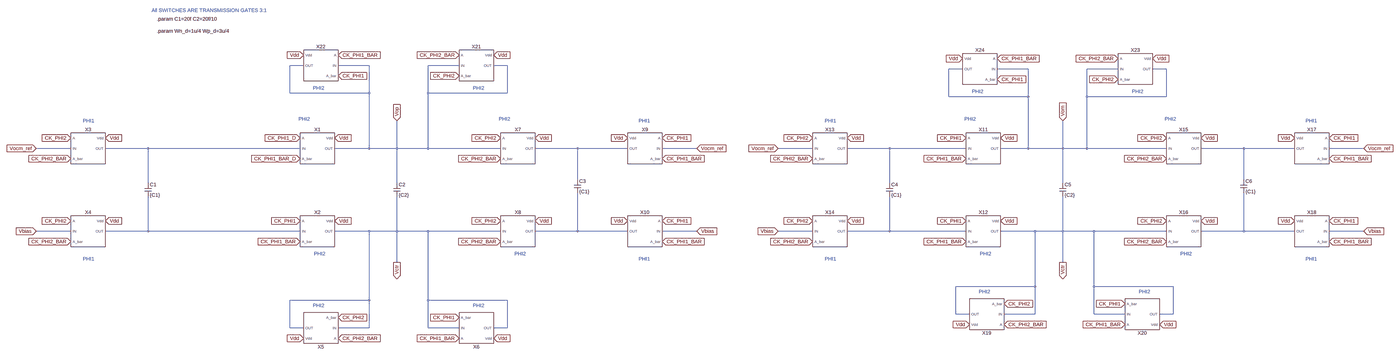
[diagram p0: schematic Draft7.asc, whole sheet]
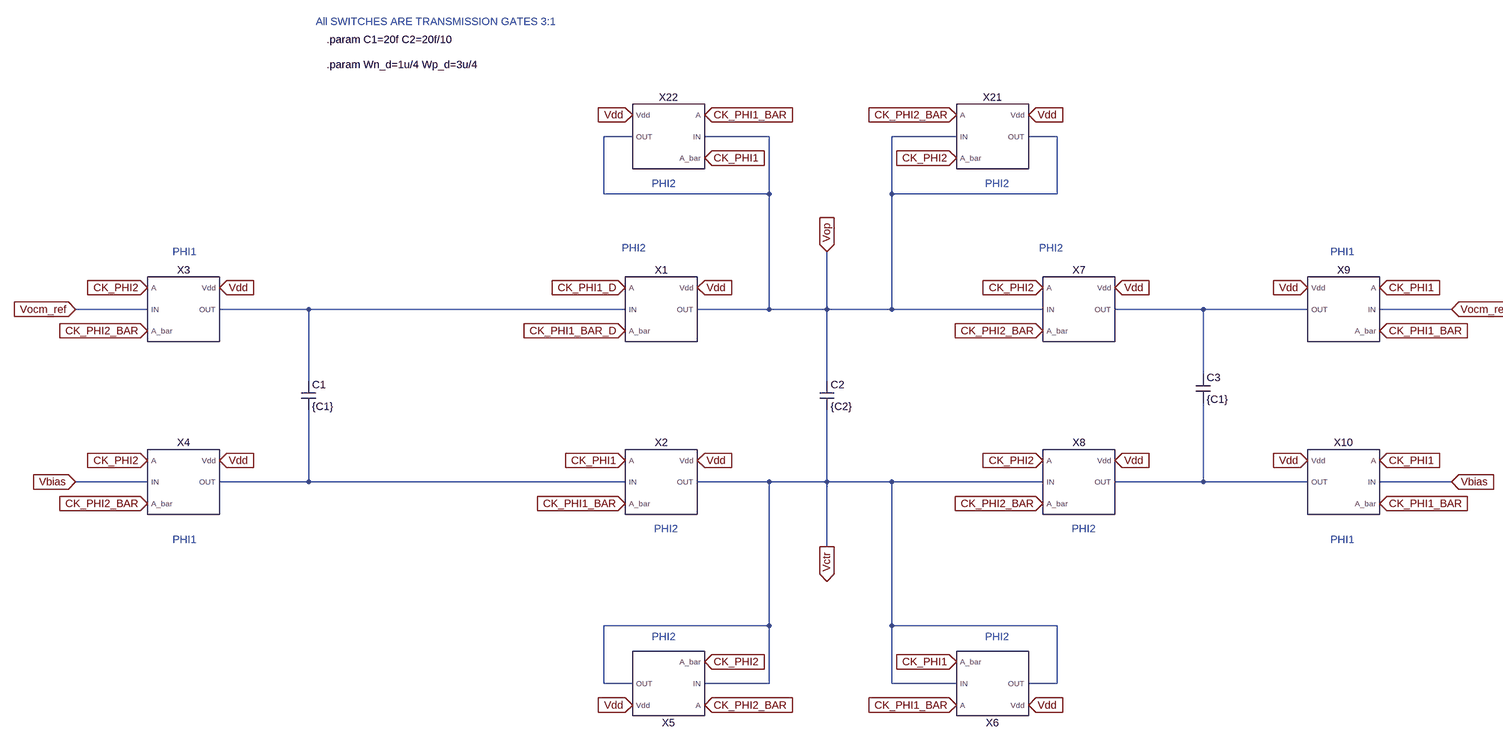
[diagram p1: schematic Draft7.asc, part, row 1 of 1, column 1 of 2]
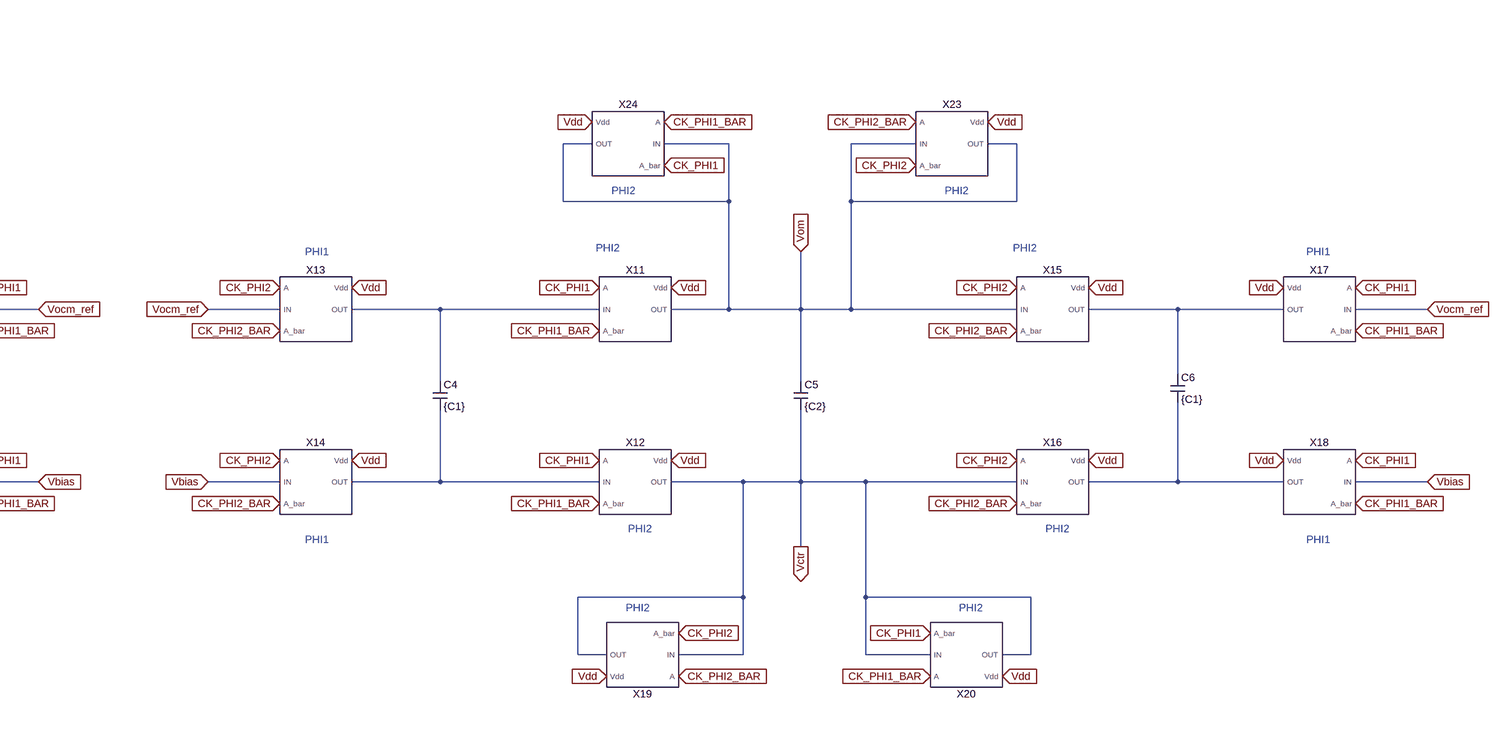
[diagram p2: schematic Draft7.asc, part, row 1 of 1, column 2 of 2]
Draft7.asc, the LTspice schematic file:
Version 4
SHEET 1 3320 712
WIRE -2560 -624 -2624 -624
WIRE -2256 -624 -2400 -624
WIRE -1840 -624 -1984 -624
WIRE -1616 -624 -1680 -624
WIRE 1168 -608 1104 -608
WIRE 1472 -608 1328 -608
WIRE 1888 -608 1744 -608
WIRE 2112 -608 2048 -608
WIRE -2624 -496 -2624 -624
WIRE -2256 -496 -2256 -624
WIRE -2256 -496 -2624 -496
WIRE -1984 -496 -1984 -624
WIRE -1616 -496 -1616 -624
WIRE -1616 -496 -1984 -496
WIRE 1104 -480 1104 -608
WIRE 1472 -480 1472 -608
WIRE 1472 -480 1104 -480
WIRE 1744 -480 1744 -608
WIRE 2112 -480 2112 -608
WIRE 2112 -480 1744 -480
WIRE -3648 -240 -3808 -240
WIRE -3280 -240 -3488 -240
WIRE -2576 -240 -3280 -240
WIRE -2256 -240 -2256 -496
WIRE -2256 -240 -2416 -240
WIRE -2128 -240 -2128 -368
WIRE -2128 -240 -2256 -240
WIRE -1984 -240 -1984 -496
WIRE -1984 -240 -2128 -240
WIRE -1648 -240 -1984 -240
WIRE -1200 -240 -1488 -240
WIRE -928 -240 -1200 -240
WIRE -608 -240 -768 -240
WIRE 112 -240 -48 -240
WIRE 480 -240 272 -240
WIRE 1184 -240 480 -240
WIRE 1472 -240 1472 -480
WIRE 1472 -240 1344 -240
WIRE 1632 -240 1632 -368
WIRE 1632 -240 1472 -240
WIRE 1744 -240 1744 -480
WIRE 1744 -240 1632 -240
WIRE 2112 -240 1744 -240
WIRE 2560 -240 2272 -240
WIRE 2832 -240 2560 -240
WIRE 3152 -240 2992 -240
WIRE -1200 -96 -1200 -240
WIRE 2560 -96 2560 -240
WIRE -3280 -80 -3280 -240
WIRE -2128 -80 -2128 -240
WIRE 480 -80 480 -240
WIRE 1632 -80 1632 -240
WIRE -3648 144 -3808 144
WIRE -3280 144 -3280 -16
WIRE -3280 144 -3488 144
WIRE -2576 144 -3280 144
WIRE -2256 144 -2416 144
WIRE -2128 144 -2128 -16
WIRE -2128 144 -2256 144
WIRE -1984 144 -2128 144
WIRE -1648 144 -1984 144
WIRE -1200 144 -1200 -32
WIRE -1200 144 -1488 144
WIRE -928 144 -1200 144
WIRE -608 144 -768 144
WIRE 112 144 -48 144
WIRE 480 144 480 -16
WIRE 480 144 272 144
WIRE 1184 144 480 144
WIRE 1504 144 1344 144
WIRE 1632 144 1632 -16
WIRE 1632 144 1504 144
WIRE 1776 144 1632 144
WIRE 2112 144 1776 144
WIRE 2560 144 2560 -32
WIRE 2560 144 2272 144
WIRE 2832 144 2560 144
WIRE 3152 144 2992 144
WIRE -2128 288 -2128 144
WIRE 1632 288 1632 144
WIRE 1504 400 1504 144
WIRE 1504 400 1136 400
WIRE 1776 400 1776 144
WIRE 2144 400 1776 400
WIRE -2256 464 -2256 144
WIRE -2256 464 -2624 464
WIRE -1984 464 -1984 144
WIRE -1616 464 -1984 464
WIRE 1136 528 1136 400
WIRE 1200 528 1136 528
WIRE 1504 528 1504 400
WIRE 1504 528 1360 528
WIRE 1776 528 1776 400
WIRE 1920 528 1776 528
WIRE 2144 528 2144 400
WIRE 2144 528 2080 528
WIRE -2624 592 -2624 464
WIRE -2560 592 -2624 592
WIRE -2256 592 -2256 464
WIRE -2256 592 -2400 592
WIRE -1984 592 -1984 464
WIRE -1840 592 -1984 592
WIRE -1616 592 -1616 464
WIRE -1616 592 -1680 592
FLAG -3808 -240 Vocm_ref
IOPIN -3808 -240 In
FLAG -2128 -368 Vop
IOPIN -2128 -368 In
FLAG -3488 -288 Vdd
IOPIN -3488 -288 In
FLAG -2416 -288 Vdd
IOPIN -2416 -288 In
FLAG -2416 96 Vdd
IOPIN -2416 96 In
FLAG -3488 96 Vdd
IOPIN -3488 96 In
FLAG -3648 -288 CK_PHI2
IOPIN -3648 -288 In
FLAG -3648 96 CK_PHI2
IOPIN -3648 96 In
FLAG -2576 -288 CK_PHI1_D
IOPIN -2576 -288 In
FLAG -2576 96 CK_PHI1
IOPIN -2576 96 In
FLAG -3648 -192 CK_PHI2_BAR
IOPIN -3648 -192 In
FLAG -3648 192 CK_PHI2_BAR
IOPIN -3648 192 In
FLAG -2576 -192 CK_PHI1_BAR_D
IOPIN -2576 -192 In
FLAG -2576 192 CK_PHI1_BAR
IOPIN -2576 192 In
FLAG -3808 144 Vbias
IOPIN -3808 144 In
FLAG -2128 288 Vctr
IOPIN -2128 288 Out
FLAG -2560 640 Vdd
IOPIN -2560 640 In
FLAG -2400 640 CK_PHI2_BAR
IOPIN -2400 640 In
FLAG -2400 544 CK_PHI2
IOPIN -2400 544 In
FLAG -1680 640 Vdd
IOPIN -1680 640 In
FLAG -1840 640 CK_PHI1_BAR
IOPIN -1840 640 In
FLAG -1840 544 CK_PHI1
IOPIN -1840 544 In
FLAG -1488 -288 Vdd
IOPIN -1488 -288 In
FLAG -1488 96 Vdd
IOPIN -1488 96 In
FLAG -1648 -288 CK_PHI2
IOPIN -1648 -288 In
FLAG -1648 96 CK_PHI2
IOPIN -1648 96 In
FLAG -1648 -192 CK_PHI2_BAR
IOPIN -1648 -192 In
FLAG -1648 192 CK_PHI2_BAR
IOPIN -1648 192 In
FLAG -608 -240 Vocm_ref
IOPIN -608 -240 In
FLAG -928 -288 Vdd
IOPIN -928 -288 In
FLAG -928 96 Vdd
IOPIN -928 96 In
FLAG -768 -288 CK_PHI1
IOPIN -768 -288 In
FLAG -768 96 CK_PHI1
IOPIN -768 96 In
FLAG -768 -192 CK_PHI1_BAR
IOPIN -768 -192 In
FLAG -768 192 CK_PHI1_BAR
IOPIN -768 192 In
FLAG -608 144 Vbias
IOPIN -608 144 In
FLAG -48 -240 Vocm_ref
IOPIN -48 -240 In
FLAG 1632 -368 Vom
IOPIN 1632 -368 In
FLAG 272 -288 Vdd
IOPIN 272 -288 In
FLAG 1344 -288 Vdd
IOPIN 1344 -288 In
FLAG 1344 96 Vdd
IOPIN 1344 96 In
FLAG 272 96 Vdd
IOPIN 272 96 In
FLAG 112 -288 CK_PHI2
IOPIN 112 -288 In
FLAG 112 96 CK_PHI2
IOPIN 112 96 In
FLAG 1184 -288 CK_PHI1
IOPIN 1184 -288 In
FLAG 1184 96 CK_PHI1
IOPIN 1184 96 In
FLAG 112 -192 CK_PHI2_BAR
IOPIN 112 -192 In
FLAG 112 192 CK_PHI2_BAR
IOPIN 112 192 In
FLAG 1184 -192 CK_PHI1_BAR
IOPIN 1184 -192 In
FLAG 1184 192 CK_PHI1_BAR
IOPIN 1184 192 In
FLAG -48 144 Vbias
IOPIN -48 144 In
FLAG 1632 288 Vctr
IOPIN 1632 288 Out
FLAG 2272 -288 Vdd
IOPIN 2272 -288 In
FLAG 2272 96 Vdd
IOPIN 2272 96 In
FLAG 2112 -288 CK_PHI2
IOPIN 2112 -288 In
FLAG 2112 96 CK_PHI2
IOPIN 2112 96 In
FLAG 2112 -192 CK_PHI2_BAR
IOPIN 2112 -192 In
FLAG 2112 192 CK_PHI2_BAR
IOPIN 2112 192 In
FLAG 3152 -240 Vocm_ref
IOPIN 3152 -240 In
FLAG 2832 -288 Vdd
IOPIN 2832 -288 In
FLAG 2832 96 Vdd
IOPIN 2832 96 In
FLAG 2992 -288 CK_PHI1
IOPIN 2992 -288 In
FLAG 2992 96 CK_PHI1
IOPIN 2992 96 In
FLAG 2992 -192 CK_PHI1_BAR
IOPIN 2992 -192 In
FLAG 2992 192 CK_PHI1_BAR
IOPIN 2992 192 In
FLAG 3152 144 Vbias
IOPIN 3152 144 In
FLAG 1200 576 Vdd
IOPIN 1200 576 In
FLAG 1360 576 CK_PHI2_BAR
IOPIN 1360 576 In
FLAG 1360 480 CK_PHI2
IOPIN 1360 480 In
FLAG 2080 576 Vdd
IOPIN 2080 576 In
FLAG 1920 576 CK_PHI1_BAR
IOPIN 1920 576 In
FLAG 1920 480 CK_PHI1
IOPIN 1920 480 In
FLAG -1680 -672 Vdd
IOPIN -1680 -672 In
FLAG -1840 -672 CK_PHI2_BAR
IOPIN -1840 -672 In
FLAG -1840 -576 CK_PHI2
IOPIN -1840 -576 In
FLAG -2560 -672 Vdd
IOPIN -2560 -672 In
FLAG -2400 -672 CK_PHI1_BAR
IOPIN -2400 -672 In
FLAG -2400 -576 CK_PHI1
IOPIN -2400 -576 In
FLAG 2048 -656 Vdd
IOPIN 2048 -656 In
FLAG 1888 -656 CK_PHI2_BAR
IOPIN 1888 -656 In
FLAG 1888 -560 CK_PHI2
IOPIN 1888 -560 In
FLAG 1168 -656 Vdd
IOPIN 1168 -656 In
FLAG 1328 -656 CK_PHI1_BAR
IOPIN 1328 -656 In
FLAG 1328 -560 CK_PHI1
IOPIN 1328 -560 In
SYMBOL tgate -2496 -240 R0
SYMATTR InstName X1
SYMBOL tgate -2496 144 R0
SYMATTR InstName X2
SYMBOL tgate -3568 -240 R0
SYMATTR InstName X3
SYMBOL tgate -3568 144 R0
SYMATTR InstName X4
SYMBOL cap -3296 -80 R0
SYMATTR InstName C1
SYMATTR Value {C1}
SYMBOL cap -2144 -80 R0
SYMATTR InstName C2
SYMATTR Value {C2}
SYMBOL tgate -2480 592 R180
SYMATTR SpiceLine L=0.28u Wn={Wn_d} Wp={Wp_d} M=1
SYMATTR InstName X5
SYMBOL tgate -1760 592 M180
SYMATTR SpiceLine L=0.28u Wn={Wn_d} Wp={Wp_d} M=1
SYMATTR InstName X6
SYMBOL tgate -1568 -240 R0
SYMATTR InstName X7
SYMBOL tgate -1568 144 R0
SYMATTR InstName X8
SYMBOL tgate -848 -240 M0
SYMATTR InstName X9
SYMBOL tgate -848 144 M0
SYMATTR InstName X10
SYMBOL cap -1216 -96 R0
SYMATTR InstName C3
SYMATTR Value {C1}
SYMBOL tgate 1264 -240 R0
SYMATTR InstName X11
SYMBOL tgate 1264 144 R0
SYMATTR InstName X12
SYMBOL tgate 192 -240 R0
SYMATTR InstName X13
SYMBOL tgate 192 144 R0
SYMATTR InstName X14
SYMBOL cap 464 -80 R0
SYMATTR InstName C4
SYMATTR Value {C1}
SYMBOL cap 1616 -80 R0
SYMATTR InstName C5
SYMATTR Value {C2}
SYMBOL tgate 2192 -240 R0
SYMATTR InstName X15
SYMBOL tgate 2192 144 R0
SYMATTR InstName X16
SYMBOL tgate 2912 -240 M0
SYMATTR InstName X17
SYMBOL tgate 2912 144 M0
SYMATTR InstName X18
SYMBOL cap 2544 -96 R0
SYMATTR InstName C6
SYMATTR Value {C1}
SYMBOL tgate 1280 528 R180
SYMATTR SpiceLine L=0.28u Wn={Wn_d} Wp={Wp_d} M=1
SYMATTR InstName X19
SYMBOL tgate 2000 528 M180
SYMATTR SpiceLine L=0.28u Wn={Wn_d} Wp={Wp_d} M=1
SYMATTR InstName X20
SYMBOL tgate -1760 -624 R0
SYMATTR SpiceLine L=0.28u Wn={Wn_d} Wp={Wp_d} M=1
SYMATTR InstName X21
SYMBOL tgate -2480 -624 M0
SYMATTR SpiceLine L=0.28u Wn={Wn_d} Wp={Wp_d} M=1
SYMATTR InstName X22
SYMBOL tgate 1968 -608 R0
SYMATTR SpiceLine L=0.28u Wn={Wn_d} Wp={Wp_d} M=1
SYMATTR InstName X23
SYMBOL tgate 1248 -608 M0
SYMATTR SpiceLine L=0.28u Wn={Wn_d} Wp={Wp_d} M=1
SYMATTR InstName X24
TEXT -2584 -376 Left 2 ;PHI2
TEXT -2512 248 Left 2 ;PHI2
TEXT -3592 -368 Left 2 ;PHI1
TEXT -3592 272 Left 2 ;PHI1
TEXT -3240 -840 Left 2 !.param C1=20f C2=20f/10
TEXT -3264 -880 Left 2 ;All SWITCHES ARE TRANSMISSION GATES 3:1
TEXT -2464 488 Right 2 ;PHI2
TEXT -3240 -784 Left 2 !.param Wn_d=1u/4 Wp_d=3u/4
TEXT -1776 488 Left 2 ;PHI2
TEXT -1656 -376 Left 2 ;PHI2
TEXT -1584 248 Left 2 ;PHI2
TEXT -824 -368 Right 2 ;PHI1
TEXT -824 272 Right 2 ;PHI1
TEXT 1176 -376 Left 2 ;PHI2
TEXT 1248 248 Left 2 ;PHI2
TEXT 168 -368 Left 2 ;PHI1
TEXT 168 272 Left 2 ;PHI1
TEXT 2104 -376 Left 2 ;PHI2
TEXT 2176 248 Left 2 ;PHI2
TEXT 2936 -368 Right 2 ;PHI1
TEXT 2936 272 Right 2 ;PHI1
TEXT 1296 424 Right 2 ;PHI2
TEXT 1984 424 Left 2 ;PHI2
TEXT -1776 -520 Left 2 ;PHI2
TEXT -2464 -520 Right 2 ;PHI2
TEXT 1952 -504 Left 2 ;PHI2
TEXT 1264 -504 Right 2 ;PHI2

The netlist it stands for:
* Draft7.asc
XX1 CK_PHI1_D CK_PHI1_BAR_D N001 Vdd Vop tgate L=0.28u Wn=1u Wp=3u M=1  ; pins A A_bar IN Vdd OUT
XX2 CK_PHI1 CK_PHI1_BAR N005 Vdd Vctr tgate L=0.28u Wn=1u Wp=3u M=1  ; pins A A_bar IN Vdd OUT
XX3 CK_PHI2 CK_PHI2_BAR Vocm_ref Vdd N001 tgate L=0.28u Wn=1u Wp=3u M=1  ; pins A A_bar IN Vdd OUT
XX4 CK_PHI2 CK_PHI2_BAR Vbias Vdd N005 tgate L=0.28u Wn=1u Wp=3u M=1  ; pins A A_bar IN Vdd OUT
C1 N001 N005 {C1}
C2 Vop Vctr {C2}
XX5 CK_PHI2_BAR CK_PHI2 Vctr Vdd Vctr tgate L=0.28u Wn={Wn_d} Wp={Wp_d} M=1  ; pins A A_bar IN Vdd OUT
XX6 CK_PHI1_BAR CK_PHI1 Vctr Vdd Vctr tgate L=0.28u Wn={Wn_d} Wp={Wp_d} M=1  ; pins A A_bar IN Vdd OUT
XX7 CK_PHI2 CK_PHI2_BAR Vop Vdd N002 tgate L=0.28u Wn=1u Wp=3u M=1  ; pins A A_bar IN Vdd OUT
XX8 CK_PHI2 CK_PHI2_BAR Vctr Vdd N006 tgate L=0.28u Wn=1u Wp=3u M=1  ; pins A A_bar IN Vdd OUT
XX9 CK_PHI1 CK_PHI1_BAR Vocm_ref Vdd N002 tgate L=0.28u Wn=1u Wp=3u M=1  ; pins A A_bar IN Vdd OUT
XX10 CK_PHI1 CK_PHI1_BAR Vbias Vdd N006 tgate L=0.28u Wn=1u Wp=3u M=1  ; pins A A_bar IN Vdd OUT
C3 N002 N006 {C1}
XX11 CK_PHI1 CK_PHI1_BAR N003 Vdd Vom tgate L=0.28u Wn=1u Wp=3u M=1  ; pins A A_bar IN Vdd OUT
XX12 CK_PHI1 CK_PHI1_BAR N007 Vdd Vctr tgate L=0.28u Wn=1u Wp=3u M=1  ; pins A A_bar IN Vdd OUT
XX13 CK_PHI2 CK_PHI2_BAR Vocm_ref Vdd N003 tgate L=0.28u Wn=1u Wp=3u M=1  ; pins A A_bar IN Vdd OUT
XX14 CK_PHI2 CK_PHI2_BAR Vbias Vdd N007 tgate L=0.28u Wn=1u Wp=3u M=1  ; pins A A_bar IN Vdd OUT
C4 N003 N007 {C1}
C5 Vom Vctr {C2}
XX15 CK_PHI2 CK_PHI2_BAR Vom Vdd N004 tgate L=0.28u Wn=1u Wp=3u M=1  ; pins A A_bar IN Vdd OUT
XX16 CK_PHI2 CK_PHI2_BAR Vctr Vdd N008 tgate L=0.28u Wn=1u Wp=3u M=1  ; pins A A_bar IN Vdd OUT
XX17 CK_PHI1 CK_PHI1_BAR Vocm_ref Vdd N004 tgate L=0.28u Wn=1u Wp=3u M=1  ; pins A A_bar IN Vdd OUT
XX18 CK_PHI1 CK_PHI1_BAR Vbias Vdd N008 tgate L=0.28u Wn=1u Wp=3u M=1  ; pins A A_bar IN Vdd OUT
C6 N004 N008 {C1}
XX19 CK_PHI2_BAR CK_PHI2 Vctr Vdd Vctr tgate L=0.28u Wn={Wn_d} Wp={Wp_d} M=1  ; pins A A_bar IN Vdd OUT
XX20 CK_PHI1_BAR CK_PHI1 Vctr Vdd Vctr tgate L=0.28u Wn={Wn_d} Wp={Wp_d} M=1  ; pins A A_bar IN Vdd OUT
XX21 CK_PHI2_BAR CK_PHI2 Vop Vdd Vop tgate L=0.28u Wn={Wn_d} Wp={Wp_d} M=1  ; pins A A_bar IN Vdd OUT
XX22 CK_PHI1_BAR CK_PHI1 Vop Vdd Vop tgate L=0.28u Wn={Wn_d} Wp={Wp_d} M=1  ; pins A A_bar IN Vdd OUT
XX23 CK_PHI2_BAR CK_PHI2 Vom Vdd Vom tgate L=0.28u Wn={Wn_d} Wp={Wp_d} M=1  ; pins A A_bar IN Vdd OUT
XX24 CK_PHI1_BAR CK_PHI1 Vom Vdd Vom tgate L=0.28u Wn={Wn_d} Wp={Wp_d} M=1  ; pins A A_bar IN Vdd OUT
* PHI2
* PHI2
* PHI1
* PHI1
.param C1=20f C2=20f/10
* All SWITCHES ARE TRANSMISSION GATES 3:1
* PHI2
.param Wn_d=1u/4 Wp_d=3u/4
* PHI2
* PHI2
* PHI2
* PHI1
* PHI1
* PHI2
* PHI2
* PHI1
* PHI1
* PHI2
* PHI2
* PHI1
* PHI1
* PHI2
* PHI2
* PHI2
* PHI2
* PHI2
* PHI2
.backanno
.end